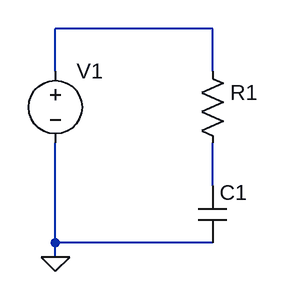
[diagram p0: schematic RC_example.asc]
RC_example.asc, the LTspice schematic file:
Version 4
SHEET 1 880 680
WIRE 256 -32 80 -32
WIRE 80 16 80 -32
WIRE 256 16 256 -32
WIRE 256 144 256 96
WIRE 80 208 80 96
WIRE 256 208 80 208
WIRE 80 224 80 208
FLAG 80 224 0
SYMBOL cap 240 144 R0
SYMATTR InstName C1
SYMATTR Value ""
SYMBOL res 240 0 R0
SYMATTR InstName R1
SYMATTR Value ""
SYMBOL voltage 80 0 R0
WINDOW 123 0 0 Left 0
WINDOW 39 0 0 Left 0
SYMATTR InstName V1
SYMATTR Value ""

The netlist it stands for:
* RC_example.asc
C1 N002 0
R1 N001 N002
V1 N001 0
.backanno
.end